# Altium project A7 Minima.PrjPcb (part 3 of 3)
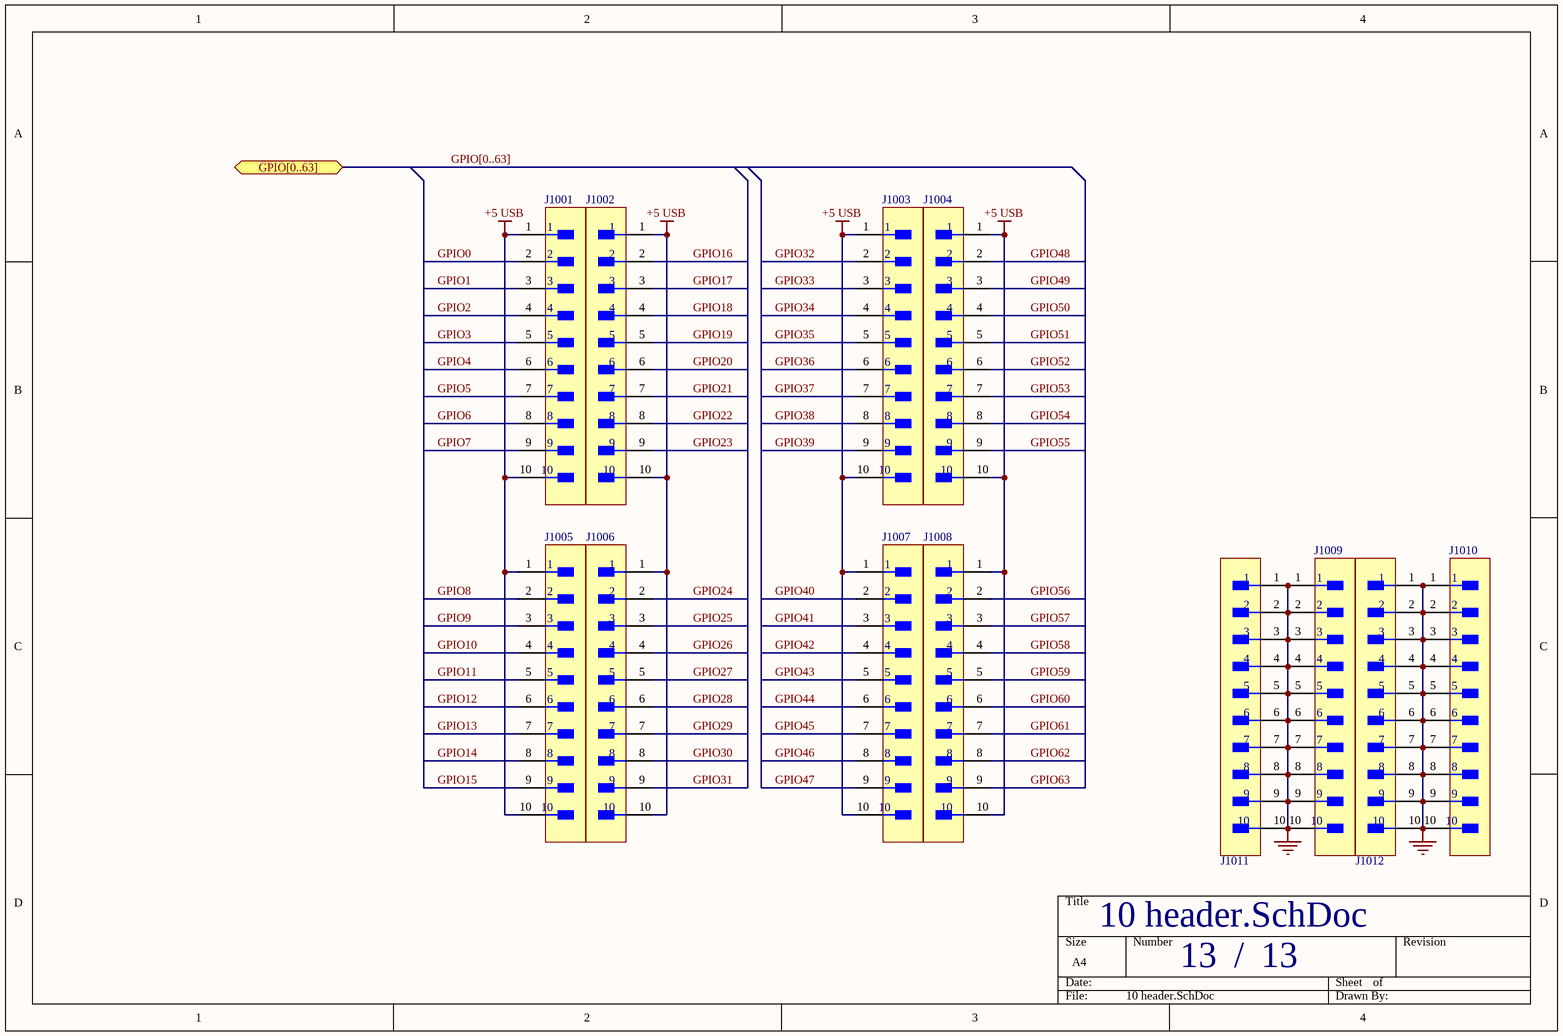
[diagram p13: 10 header.SchDoc]

## Nets that join several sheets
+0.75 VTT: 2 power (C201.1 U201.3 U201.5), 8 ddr3 termination (32 pins)
+0.75 VTTREF: 2 power (C203.1 U201.6), DM (U701_DM#1.H1 U701_DM#1.M8), DM (U701_DM#2.H1 U701_DM#2.M8)
+1.0: 2 power (R201.1), PW/BC (C302_PW_BC#1.1 C303_PW_BC#1.1 C304_PW_BC#1.1 L301_PW_BC#1.2), 5-1 fgpa power (37 pins)
+1.5 DDR3: 2 power (C202.1 R209.1 U201.1 U201.2), PW/BC (C302_PW_BC#4.1 C303_PW_BC#4.1 C304_PW_BC#4.1 L301_PW_BC#4.2), 5-1 fgpa power (25 pins), 6 clock (C602.1 U601.1), DM (36 pins), DM (36 pins), 8 ddr3 termination (C805.1)
+1.8: 2 power (R204.1), PW/BC (C302_PW_BC#2.1 C303_PW_BC#2.1 C304_PW_BC#2.1 L301_PW_BC#2.2), 5-1 fgpa power (13 pins)
+3.3: 2 power (R206.1 R207.1), PW/BC (C302_PW_BC#3.1 C303_PW_BC#3.1 C304_PW_BC#3.1 L301_PW_BC#3.2), 5-1 fgpa power (29 pins), 9 onboard (9 pins), 6 clock (8 pins), 5-3 fpga bank 14-16 (R521.1), 4 jtag uart (19 pins), 5-2 fpga config (18 pins)
+5 USB: 2 power (5 pins), PW/BC (C301_PW_BC#1.1 R301_PW_BC#1.1 U301_PW_BC#1.3), PW/BC (C301_PW_BC#2.1 R301_PW_BC#2.1 U301_PW_BC#2.3), PW/BC (C301_PW_BC#3.1 R301_PW_BC#3.1 U301_PW_BC#3.3), PW/BC (C301_PW_BC#4.1 R301_PW_BC#4.1 U301_PW_BC#4.3), 9 onboard (19 pins), 4 jtag uart (J401.A4-B9 J401.B4-A9), 10 header (16 pins)
GND: 2 power (12 pins), PW/BC (6 pins), PW/BC (6 pins), PW/BC (6 pins), PW/BC (6 pins), 5-1 fgpa power (104 pins), 9 onboard (32 pins), 6 clock (8 pins), 4 jtag uart (37 pins), 5-2 fpga config (18 pins), DM (40 pins), DM (40 pins), 8 ddr3 termination (9 pins), 10 header (40 pins)
A0: 5-4 fpga bank 34-35 (U501.G4), DM (U701_DM#1.N3), DM (U701_DM#2.N3), 8 ddr3 termination (R801.1)
A1: 5-4 fpga bank 34-35 (U501.B6), DM (U701_DM#1.P7), DM (U701_DM#2.P7), 8 ddr3 termination (R802.1)
A2: 5-4 fpga bank 34-35 (U501.E6), DM (U701_DM#1.P3), DM (U701_DM#2.P3), 8 ddr3 termination (R803.1)
A3: 5-4 fpga bank 34-35 (U501.A4), DM (U701_DM#1.N2), DM (U701_DM#2.N2), 8 ddr3 termination (R804.1)
A4: 5-4 fpga bank 34-35 (U501.F1), DM (U701_DM#1.P8), DM (U701_DM#2.P8), 8 ddr3 termination (R805.1)
A5: 5-4 fpga bank 34-35 (U501.B4), DM (U701_DM#1.P2), DM (U701_DM#2.P2), 8 ddr3 termination (R806.1)
A6: 5-4 fpga bank 34-35 (U501.G2), DM (U701_DM#1.R8), DM (U701_DM#2.R8), 8 ddr3 termination (R807.1)
A7: 5-4 fpga bank 34-35 (U501.E5), DM (U701_DM#1.R2), DM (U701_DM#2.R2), 8 ddr3 termination (R808.1)
A8: 5-4 fpga bank 34-35 (U501.G1), DM (U701_DM#1.T8), DM (U701_DM#2.T8), 8 ddr3 termination (R809.1)
A9: 5-4 fpga bank 34-35 (U501.C2), DM (U701_DM#1.R3), DM (U701_DM#2.R3), 8 ddr3 termination (R810.1)
A10: 5-4 fpga bank 34-35 (U501.G3), DM (U701_DM#1.L7), DM (U701_DM#2.L7), 8 ddr3 termination (R811.1)
A11: 5-4 fpga bank 34-35 (U501.D2), DM (U701_DM#1.R7), DM (U701_DM#2.R7), 8 ddr3 termination (R812.1)
A12: 5-4 fpga bank 34-35 (U501.C5), DM (U701_DM#1.N7), DM (U701_DM#2.N7), 8 ddr3 termination (R813.1)
A13: 5-4 fpga bank 34-35 (U501.C1), DM (U701_DM#1.T3), DM (U701_DM#2.T3), 8 ddr3 termination (R814.1)
A14: 5-4 fpga bank 34-35 (U501.D3), DM (U701_DM#1.T7), DM (U701_DM#2.T7), 8 ddr3 termination (R815.1)
B0D0: 5-4 fpga bank 34-35 (U501.M1), DM (U701_DM#2.D7)
B0D1: 5-4 fpga bank 34-35 (U501.L4), DM (U701_DM#2.C3)
B0D2: 5-4 fpga bank 34-35 (U501.L1), DM (U701_DM#2.C8)
B0D3: 5-4 fpga bank 34-35 (U501.L5), DM (U701_DM#2.C2)
B0D4: 5-4 fpga bank 34-35 (U501.M3), DM (U701_DM#2.A7)
B0D5: 5-4 fpga bank 34-35 (U501.K5), DM (U701_DM#2.A2)
B0D6: 5-4 fpga bank 34-35 (U501.M2), DM (U701_DM#2.B8)
B0D7: 5-4 fpga bank 34-35 (U501.K3), DM (U701_DM#2.A3)
B1D0: 5-4 fpga bank 34-35 (U501.M4), DM (U701_DM#2.E3)
B1D1: 5-4 fpga bank 34-35 (U501.P3), DM (U701_DM#2.F7)
B1D2: 5-4 fpga bank 34-35 (U501.N5), DM (U701_DM#2.F2)
B1D3: 5-4 fpga bank 34-35 (U501.P4), DM (U701_DM#2.F8)
B1D4: 5-4 fpga bank 34-35 (U501.P5), DM (U701_DM#2.H3)
B1D5: 5-4 fpga bank 34-35 (U501.R1), DM (U701_DM#2.H8)
B1D6: 5-4 fpga bank 34-35 (U501.M6), DM (U701_DM#2.G2)
B1D7: 5-4 fpga bank 34-35 (U501.T1), DM (U701_DM#2.H7)
B2D0: 5-4 fpga bank 34-35 (U501.V5), DM (U701_DM#1.D7)
B2D1: 5-4 fpga bank 34-35 (U501.U3), DM (U701_DM#1.C3)
B2D2: 5-4 fpga bank 34-35 (U501.R3), DM (U701_DM#1.C8)
B2D3: 5-4 fpga bank 34-35 (U501.U4), DM (U701_DM#1.C2)
B2D4: 5-4 fpga bank 34-35 (U501.T3), DM (U701_DM#1.A7)
B2D5: 5-4 fpga bank 34-35 (U501.U1), DM (U701_DM#1.A2)
B2D6: 5-4 fpga bank 34-35 (U501.T4), DM (U701_DM#1.B8)
B2D7: 5-4 fpga bank 34-35 (U501.V1), DM (U701_DM#1.A3)
B3: 5-4 fpga bank 34-35 (U501.B3), DM (U701_DM#1.M2), DM (U701_DM#2.M2), 8 ddr3 termination (R816.1)
B3D0: 5-4 fpga bank 34-35 (U501.U6), DM (U701_DM#1.E3)
B3D1: 5-4 fpga bank 34-35 (U501.R6), DM (U701_DM#1.F7)
B3D2: 5-4 fpga bank 34-35 (U501.T6), DM (U701_DM#1.F2)
B3D3: 5-4 fpga bank 34-35 (U501.T8), DM (U701_DM#1.F8)
B3D4: 5-4 fpga bank 34-35 (U501.V6), DM (U701_DM#1.H3)
B3D5: 5-4 fpga bank 34-35 (U501.V7), DM (U701_DM#1.H8)
B3D6: 5-4 fpga bank 34-35 (U501.R5), DM (U701_DM#1.G2)
B3D7: 5-4 fpga bank 34-35 (U501.U7), DM (U701_DM#1.H7)
BA1: 5-4 fpga bank 34-35 (U501.E2), DM (U701_DM#1.N8), DM (U701_DM#2.N8), 8 ddr3 termination (R817.1)
BA2: 5-4 fpga bank 34-35 (U501.F3), DM (U701_DM#1.M3), DM (U701_DM#2.M3), 8 ddr3 termination (R818.1)
BUTTON: 9 onboard (R911.1 SW901.3 SW901.4), 5-3 fpga bank 14-16 (U501.V17)
CLK27M: 6 clock (R603.2), 5-3 fpga bank 14-16 (U501.H16)
CLK50M: 6 clock (R601.2 U601.4), 5-3 fpga bank 14-16 (U501.P17)
CLK50M1V5: 6 clock (R602.2), 5-4 fpga bank 34-35 (U501.F4)
DDRB0.DM: 5-4 fpga bank 34-35 (U501.L3), DM (U701_DM#2.D3)
DDRB0.DQS_N: 5-4 fpga bank 34-35 (U501.N1), DM (U701_DM#2.B7)
DDRB0.DQS_P: 5-4 fpga bank 34-35 (U501.N2), DM (U701_DM#2.C7)
DDRB1.DM: 5-4 fpga bank 34-35 (U501.N4), DM (U701_DM#2.E7)
DDRB1.DQS_N: 5-4 fpga bank 34-35 (U501.R2), DM (U701_DM#2.G3)
DDRB1.DQS_P: 5-4 fpga bank 34-35 (U501.P2), DM (U701_DM#2.F3)
DDRB2.DM: 5-4 fpga bank 34-35 (U501.V4), DM (U701_DM#1.D3)
DDRB2.DQS_N: 5-4 fpga bank 34-35 (U501.V2), DM (U701_DM#1.B7)
DDRB2.DQS_P: 5-4 fpga bank 34-35 (U501.U2), DM (U701_DM#1.C7)
DDRB3.DM: 5-4 fpga bank 34-35 (U501.R7), DM (U701_DM#1.E7)
DDRB3.DQS_N: 5-4 fpga bank 34-35 (U501.V9), DM (U701_DM#1.G3)
DDRB3.DQS_P: 5-4 fpga bank 34-35 (U501.U9), DM (U701_DM#1.F3)
DDRCTL.CAS#: 5-4 fpga bank 34-35 (U501.D4), DM (U701_DM#1.K3), DM (U701_DM#2.K3), 8 ddr3 termination (R821.1)
DDRCTL.CK_N: 5-4 fpga bank 34-35 (U501.A1), DM (U701_DM#1.K7), DM (U701_DM#2.K7), 8 ddr3 termination (R826.1)
DDRCTL.CK_P: 5-4 fpga bank 34-35 (U501.B1), DM (U701_DM#1.J7), DM (U701_DM#2.J7), 8 ddr3 termination (R825.2)
DDRCTL.CKE: 5-4 fpga bank 34-35 (U501.E1), DM (U701_DM#1.K9), DM (U701_DM#2.K9), 8 ddr3 termination (R819.1)
DDRCTL.CS#: 5-4 fpga bank 34-35 (U501.A3), DM (U701_DM#1.L2), DM (U701_DM#2.L2), 8 ddr3 termination (R823.1)
DDRCTL.ODT: 5-4 fpga bank 34-35 (U501.B2), DM (U701_DM#1.K1), DM (U701_DM#2.K1), 8 ddr3 termination (R824.1)
DDRCTL.RAS#: 5-4 fpga bank 34-35 (U501.E3), DM (U701_DM#1.J3), DM (U701_DM#2.J3), 8 ddr3 termination (R822.1)
DDRCTL.RESET#: 5-4 fpga bank 34-35 (U501.D5), DM (U701_DM#1.T2), DM (U701_DM#2.T2), 8 ddr3 termination (R827.1)
DDRCTL.WE#: 5-4 fpga bank 34-35 (U501.C4), DM (U701_DM#1.L3), DM (U701_DM#2.L3), 8 ddr3 termination (R820.1)
EN: 2 power (R202.2), PW/BC (U301_PW_BC#1.7)
EN: PW/BC (R301_PW_BC#1.2 U301_PW_BC#1.2), PW/BC (U301_PW_BC#2.7)
EN: PW/BC (R301_PW_BC#2.2 U301_PW_BC#2.2), PW/BC (U301_PW_BC#3.7)
EN: PW/BC (R301_PW_BC#3.2 U301_PW_BC#3.2), PW/BC (U301_PW_BC#4.7)
FB: 2 power (R201.2 R203.1), PW/BC (C304_PW_BC#1.2 U301_PW_BC#1.1)
FB: 2 power (R204.2 R205.1), PW/BC (C304_PW_BC#2.2 U301_PW_BC#2.1)
FB: 2 power (R206.2 R208.1), PW/BC (C304_PW_BC#3.2 U301_PW_BC#3.1)
FB: 2 power (R209.2 R210.1), PW/BC (C304_PW_BC#4.2 U301_PW_BC#4.1)
HDMI.CLK_N: 9 onboard (C908.1), 5-3 fpga bank 14-16 (U501.C17)
HDMI.CLK_P: 9 onboard (C907.1), 5-3 fpga bank 14-16 (U501.C16)
HDMI.D0_N: 9 onboard (C906.1), 5-3 fpga bank 14-16 (U501.A16)
HDMI.D0_P: 9 onboard (C905.1), 5-3 fpga bank 14-16 (U501.A15)
HDMI.D1_N: 9 onboard (C904.1), 5-3 fpga bank 14-16 (U501.C14)
HDMI.D1_P: 9 onboard (C903.1), 5-3 fpga bank 14-16 (U501.D14)
HDMI.D2_N: 9 onboard (C902.1), 5-3 fpga bank 14-16 (U501.B12)
HDMI.D2_P: 9 onboard (C901.1), 5-3 fpga bank 14-16 (U501.C12)
HDMI.HPD#: 9 onboard (Q903.3 R905.2), 5-3 fpga bank 14-16 (U501.G13)
HDMI.SCL: 9 onboard (Q901.2 R901.1), 5-3 fpga bank 14-16 (U501.C15)
HDMI.SDA: 9 onboard (Q902.2 R902.1), 5-3 fpga bank 14-16 (U501.D15)
JTAG.TCK: 4 jtag uart (R404.1), 5-2 fpga config (R507.2 R508.2 U501.E10)
JTAG.TDI: 4 jtag uart (R405.1), 5-2 fpga config (R505.2 U501.E11)
JTAG.TDO: 4 jtag uart (R406.1), 5-2 fpga config (R506.2 U501.E13)
JTAG.TMS: 4 jtag uart (R407.1), 5-2 fpga config (R504.2 R509.2 U501.E12)
LED0: 9 onboard (R909.1), 5-3 fpga bank 14-16 (U501.L18)
LED1: 9 onboard (R910.1), 5-3 fpga bank 14-16 (U501.M18)
PG: 2 power (Q201.1), PW/BC (R301_PW_BC#4.2 U301_PW_BC#4.2)
QSPI.CS#: 5-3 fpga bank 14-16 (U501.L13), 5-2 fpga config (R513.2 U502.1)
QSPI.DQ0: 5-3 fpga bank 14-16 (U501.K17), 5-2 fpga config (U502.5)
QSPI.DQ1: 5-3 fpga bank 14-16 (U501.K18), 5-2 fpga config (U502.2)
QSPI.DQ2: 5-3 fpga bank 14-16 (U501.L14), 5-2 fpga config (R515.2 U502.3)
QSPI.DQ3: 5-3 fpga bank 14-16 (U501.M14), 5-2 fpga config (R514.2 U502.7)
RGB_DAT: 9 onboard (R914.1), 5-3 fpga bank 14-16 (U501.B11)
SW.SW0: 5-3 fpga bank 14-16 (U501.U17), 5-2 fpga config (R517.1 SW502.1)
SW.SW1: 5-3 fpga bank 14-16 (U501.V16), 5-2 fpga config (R518.1 SW502.2)
SW.SW2: 5-3 fpga bank 14-16 (U501.V15), 5-2 fpga config (R519.1 SW502.3)
UART.CTS#: 5-3 fpga bank 14-16 (U501.D18), 4 jtag uart (U401.41)
UART.RTS#: 5-3 fpga bank 14-16 (U501.B18), 4 jtag uart (U401.40)
UART.RX: 5-3 fpga bank 14-16 (U501.A18), 4 jtag uart (U401.38)
UART.TX: 5-3 fpga bank 14-16 (U501.B17), 4 jtag uart (U401.39)